# Altium project AFE001.PrjPcb
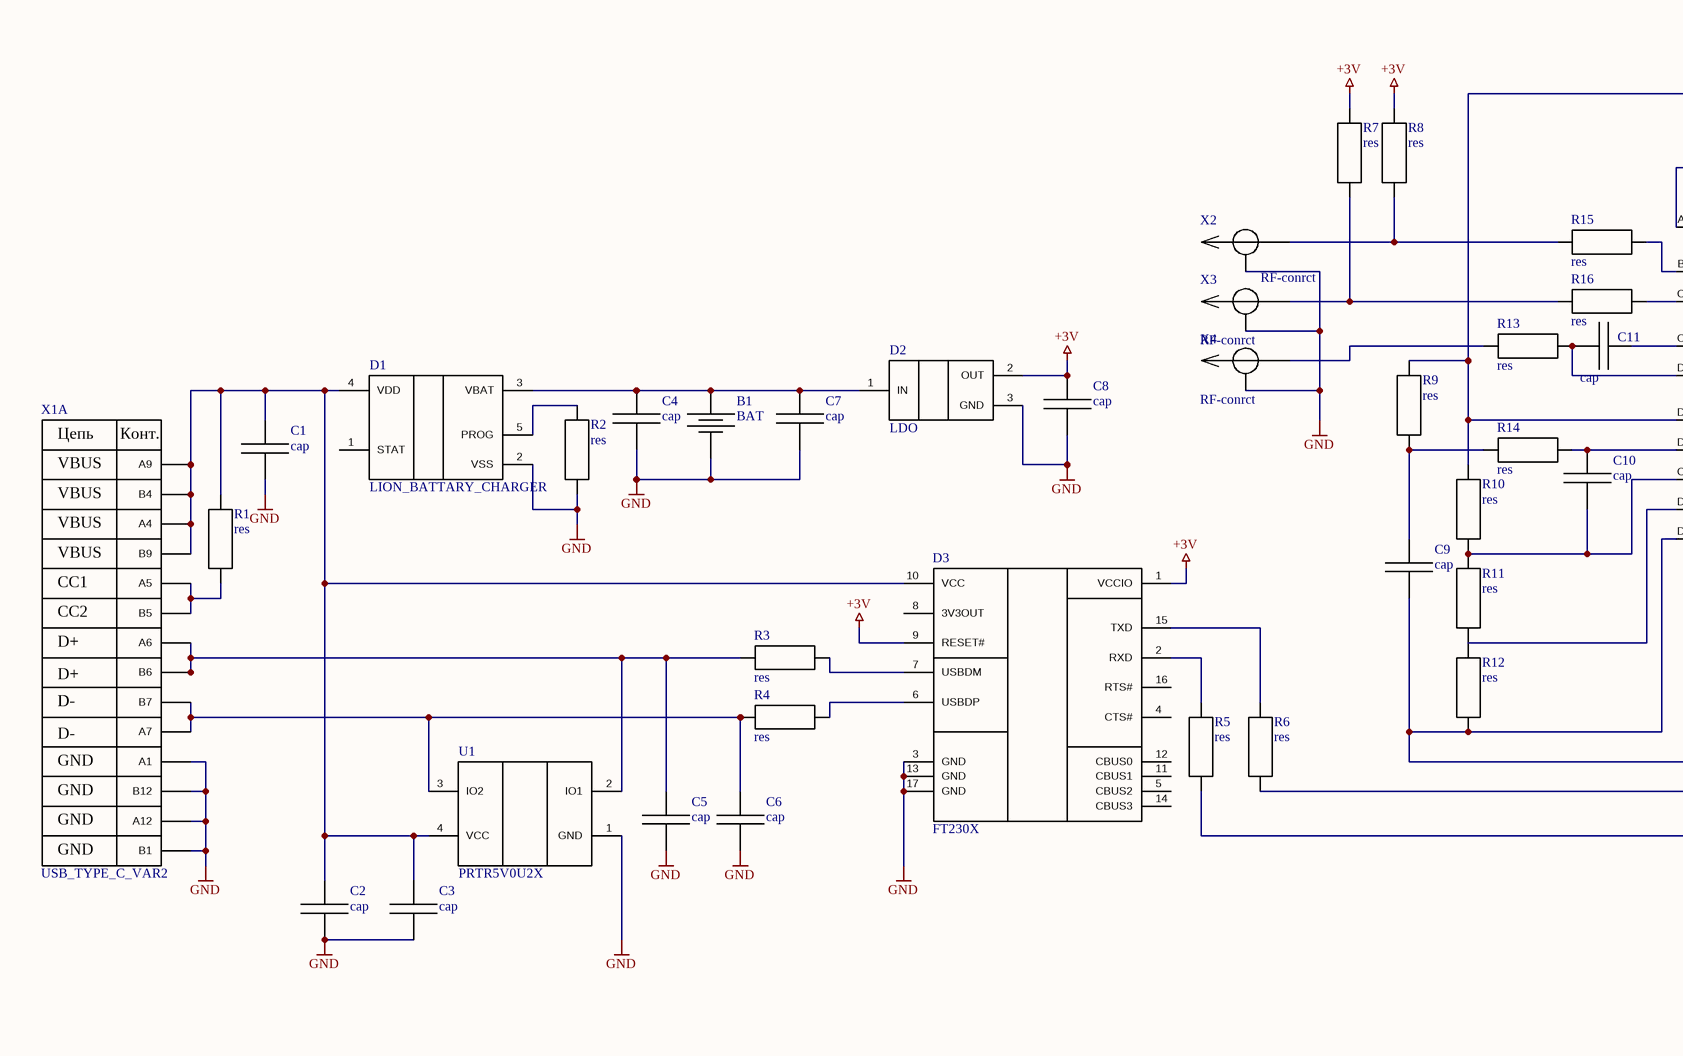
[diagram p0: Sheet1.SchDoc, left]
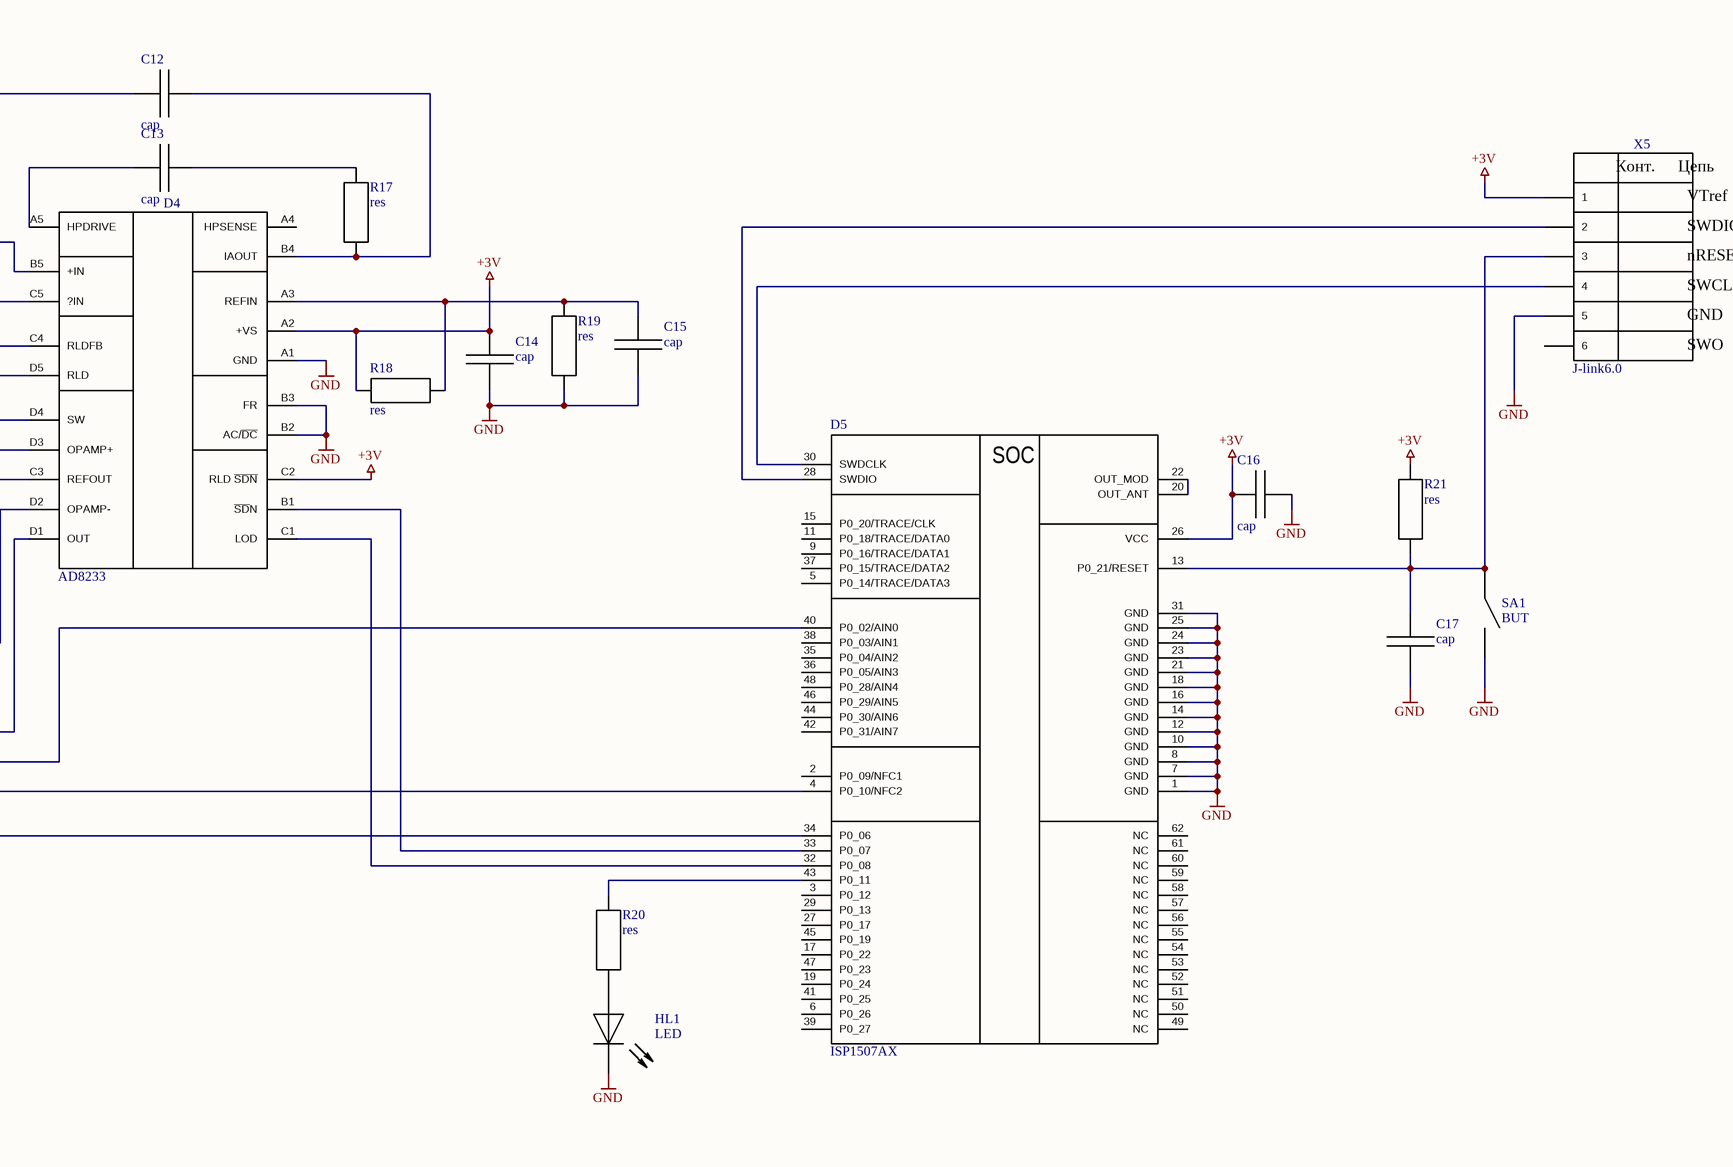
[diagram p1: Sheet1.SchDoc, right]
1 sheet, 52 parts. Net scope: global (net labels, ports and power ports of the same name join across sheets).
Board file: PCB1.PcbDoc

## Sheet Sheet1.SchDoc
size 839 x 594 mm

### Parts
B1  BAT  [lION]
C1  cap  [CAP0805]
C2  cap  [CAP0805]
C3  cap  [CAP0402]
C4  cap  [CAP0805]
C5  cap  [CAP0402]
C6  cap  [CAP0402]
C7  cap  [CAP0402]
C8  cap  [CAP0402]
C9  cap  [CAP0402]
C10  cap  [CAP0402]
C11  cap  [CAP0402]
C12  cap  [CAP0402]
C13  cap  [CAP0402]
C14  cap  [CAP0402]
C15  cap  [CAP0402]
C16  cap  [CAP0402]
C17  cap  [CAP0402]
D1  LION_BATTARY_CHARGER  [SOT95P270X15-5N]
D2  LDO  [SOT89-150P409X160-3N]
D3  FT230X  [PQFN65P400X400X80_HS-17N]
D4  AD8233  [BGA20C40P5X4_204X171X56]
D5  ISP1507AX  [LGA6C330P2X3_800X800X100]
HL1  LED  [Chip2PinSM127P600-8N]
R1  res  [RES0402]
R2  res  [RES0402]
R3  res  [RES0402]
R4  res  [RES0402]
R5  res  [RES0402]
R6  res  [RES0402]
R7  res  [RES0402]
R8  res  [RES0402]
R9  res  [RES0402]
R10  res  [RES0402]
R11  res  [RES0402]
R12  res  [RES0402]
R13  res  [RES0402]
R14  res  [RES0402]
R15  res  [RES0402]
R16  res  [RES0402]
R17  res  [RES0402]
R18  res  [RES0402]
R19  res  [RES0402]
R20  res  [RES0402]
R21  res  [RES0402]
SA1  BUT  [IT-1184]
U1  PRTR5V0U2X  [SOT143]
X1  USB_TYPE_C_VAR2  [WM12856CT-ND]  (part A of 2)
X2  RF-conrct  [1909763-1]
X3  RF-conrct  [1909763-1]
X4  RF-conrct  [1909763-1]
X5  J-link6.0  [J-Link6.]

### Nets
+3V: C8.1 C14.1 C16.1 D2.2(OUT) D3.1(VCCIO) D3.9(RESET#) D4.A2(+VS) D4.C2(RLD_~{SDN}) D5.26(VCC) R7.1 R8.1 R18.2 R21.1 X5.1
GND: B1.2 C1.2 C2.2 C3.2 C4.2 C5.2 C6.2 C7.2 C8.2 C14.2 C15.2 C16.2 C17.2 D1.2(VSS) D2.3(GND) D3.3(GND) D3.13(GND) D3.17(GND) D4.A1(GND) D4.B2(AC/~{DC}) D4.B3(FR) D5.1(GND) D5.7(GND) D5.8(GND) D5.10(GND) D5.12(GND) D5.14(GND) D5.16(GND) D5.18(GND) D5.21(GND) D5.23(GND) D5.24(GND) D5.25(GND) D5.31(GND) HL1.2(K) R2.2 R19.1 SA1.2 U1.1(GND) X1.A1 X1.A12 X1.B1 X1.B12 X2.2 X3.2 X4.2 X5.5
NetB1_1: B1.1 C4.1 C7.1 D1.3(VBAT) D2.1(IN)
NetC1_1: C1.1 C2.1 C3.1 D1.4(VDD) D3.10(VCC) R1.1 U1.4(VCC) X1.A4 X1.A9 X1.B4 X1.B9
NetC5_1: C5.1 R3.2 U1.2(IO1) X1.A6 X1.B6
NetC6_1: C6.1 R4.2 U1.3(IO2) X1.A7 X1.B7
NetC9_1: C9.1 R9.1 R14.2
NetC9_2: C9.2 D4.D1(OUT) D5.40(P0_02/AIN0) R12.1
NetC10_1: C10.1 D4.D3(OPAMP+) R14.1
NetC10_2: C10.2 D4.C3(REFOUT) R10.2 R11.1
NetC11_1: C11.1 D4.C4(RLDFB)
NetC11_2: C11.2 D4.D5(RLD) R13.1
NetC12_1: C12.1 D4.B4(IAOUT) R17.2
NetC12_2: C12.2 D4.D4(SW) R9.2 R10.1
NetC13_1: C13.1 R17.1
NetC13_2: C13.2 D4.A5(HPDRIVE)
NetC15_1: C15.1 D4.A3(REFIN) R18.1 R19.2
NetC17_1: C17.1 D5.13(P0_21/RESET) R21.2 SA1.1 X5.3
NetD1_5: D1.5(PROG) R2.1
NetD3_2: D3.2(RXD) R5.1
NetD3_6: D3.6(USBDP) R4.1
NetD3_7: D3.7(USBDM) R3.1
NetD3_15: D3.15(TXD) R6.1
NetD4_B1: D4.B1(~{SD}N) D5.33(P0_07)
NetD4_B5: D4.B5(+IN) R15.1
NetD4_C1: D4.C1(LOD) D5.32(P0_08)
NetD4_C5: D4.C5(?IN) R16.1
NetD4_D2: D4.D2(OPAMP-) R11.2 R12.2
NetD5_4: D5.4(P0_10/NFC2) R6.2
NetD5_20: D5.20(OUT_ANT) D5.22(OUT_MOD)
NetD5_28: D5.28(SWDIO) X5.2
NetD5_30: D5.30(SWDCLK) X5.4
NetD5_34: D5.34(P0_06) R5.2
NetD5_43: D5.43(P0_11) R20.1
NetHL1_1: HL1.1(A) R20.2
NetR1_2: R1.2 X1.A5 X1.B5
NetR7_2: R7.2 R16.2 X3.1
NetR8_2: R8.2 R15.2 X2.1
NetR13_2: R13.2 X4.1

Not connected (* = marked no-connect by the designer): D1 1(STAT); D3 4(CTS#) 5(CBUS2) 8(3V3OUT) 11(CBUS1) 12(CBUS0) 14(CBUS3) 16(RTS#); D4 A4(HPSENSE); D5 2(P0_09/NFC1) 3(P0_12) 5(P0_14/TRACE/DATA3) 6(P0_26) 9(P0_16/TRACE/DATA1) 11(P0_18/TRACE/DATA0) 15(P0_20/TRACE/CLK) 17(P0_22) 19(P0_24) 27(P0_17) 29(P0_13) 35(P0_04/AIN2) 36(P0_05/AIN3) 37(P0_15/TRACE/DATA2) 38(P0_03/AIN1) 39(P0_27) 41(P0_25) 42(P0_31/AIN7) 44(P0_30/AIN6) 45(P0_19) 46(P0_29/AIN5) 47(P0_23) 48(P0_28/AIN4) 49(NC) 50(NC) 51(NC) 52(NC) 53(NC) 54(NC) 55(NC) 56(NC) 57(NC) 58(NC) 59(NC) 60(NC) 61(NC) 62(NC); X5 6

### Notes on the sheet
- Подп. и дата
- Инв.№ дубл.
- Взам.инв.№
- Подп.и дата
- Инв.№ подл.
- Изм.
- Лист
- № докум.
- Подп.
- Дата
- Формат  A1
- (in symbol ISP1507) SOC
- (in symbol J-link6) Конт.; Цепь; VTref; SWDIO; nRESET; SWCLK; GND; SWO
- (in symbol WM12856CT-ND, part A) Цепь; Конт.; VBUS; CC1; CC2; D+; D-; GND

### Library data of the parts
B1 = Li-Polymer 402025: manufacturer: PKCELL; capasisctance: 150e-3; voltage: 3.7; Part Number: Li-Polymer 402025; datasheet: https://cdn-shop.adafruit.com/product-files/1317/C1515_-_Li-Polymer_402025_150mAh_3.7V_with_PCM.pdf
C1 C2 C4 = GRM21BR71C475KA73L: manufacturer: Murata; capasisctance: 4.7e-6; voltage: 16V; Part Number: GRM21BR71C475KA73L; package: 0805; datasheet: https://static.c
C3 C7 C8 C16 C17 = GRM155R71C104K: manufacturer: Murata; capasisctance: 1e-7; voltage: 10V; Part Number: GRM155R71C104K; package: 0402; datasheet: https://static.chipdip.ru/lib/250/DOC000250694.pdf
C5 C6 = GRM1555C1H470J: manufacturer: Murata; capasisctance: 4.7e-12; voltage: 16V; Part Number: GRM1555C1H470J; package: 0402; datasheet: https://static.c
C9 = GRM155R71H332KA01D: manufacturer: Murata; capasisctance: 3.3e-9; voltage: 50V; Part Number: GRM155R71H332KA01D; package: 0402; datasheet: https://static.c
C10 = GRM155R71H223KA12B: manufacturer: Murata; capasisctance: 22e-9; voltage: 50V; Part Number: GRM155R71H223KA12B; package: 0402; datasheet: https://static.c
C11 = GRM1555C1E102JA01D: manufacturer: Murata; capasisctance: 1e-9; voltage: 16V; Part Number: GRM1555C1E102JA01D; package: 0402; datasheet: https://static.c
C12 C13 = GRM155R71C224KA12D: manufacturer: Murata; capasisctance: 22e-8; voltage: 16V; Part Number: GRM155R71C224KA12D; package: 0402; datasheet: https://static.c
C14 C15 = GRM155R71C104K: manufacturer: Murata; capasisctance: 10e-5; voltage: 10V; Part Number: GRM155R71C104K; package: 0402; datasheet: https://static.chipdip.ru/lib/250/DOC000250694.pdf
D1 = MCP73831/2: manufacturer: Microchip; Part number: MCP73831/2; datasheet: D:\test_work\AFE\datasheets\power manadge\21984e.pdf
D2 = NJM78L03A: manufacturer: JRC; Part number: NJM78L03A; datasheet: D:\test_work\AFE\datasheets\power manadge\DOC000222907.pdf
D3 = FT230X: manufacturer: FTDI Chip; Part number: FT230X; datasheet: D:\test_work\AFE\datasheets\uart\DS_FT230X-5395.pdf
D4 = AD8233: manufacturer: Analog Devices; Part number: AD8233; datasheet: D:\test_work\AFE\datasheets\ad8233\AD8233.pdf
D5 = ISP1507: manufacturer: Insight Sip; Part number: ISP1507; datasheet: D:\test_work\AFE\datasheets\isp1507\isp_ble_DS1507-1221980.pdf
HL1 = KPHHS-1005CGCK: manufacturer: Kingbring; Part Number: KPHHS-1005CGCK; package: 0603; datasheet: https://static.chipdip.ru/lib/195/DOC000195322.pdf
R1 R10 R11 = RC0402FR-07100KL: manufacturer: YAGEO; resistanse: 10e5; power: 0.062; Part Number: RC0402FR-07100KL; package: 0402; datasheet: ttps://ru.mouser.com/datasheet/2/447/PYu-RC_Group_51_RoHS_L_10-1527934.pdf
R2 = RC0402FR-0713KL: manufacturer: YAGEO; resistanse: 13e3; power: 0.062; Part Number: RC0402FR-0713KL; package: 0402; datasheet: ttps://ru.mouser.com/datasheet/2/447/PYu-RC_Group_51_RoHS_L_10-1527934.pdf
R3 R4 = RC0402FR-0727RL: manufacturer: YAGEO; resistanse: 27e0; power: 0.062; Part Number: RC0402FR-0727RL; package: 0402; datasheet: ttps://ru.mouser.com/datasheet/2/447/PYu-RC_Group_51_RoHS_L_10-1527934.pdf
R5 R6 = RC0402JR-070RL: manufacturer: YAGEO; resistanse: 0; power: 0.062; Part Number: RC0402JR-070RL; package: 0402; datasheet: ttps://ru.mouser.com/datasheet/2/447/PYu-RC_Group_51_RoHS_L_10-1527934.pdf
R7 R8 R17-R19 = RC0402FR-0710ML: manufacturer: YAGEO; resistanse: 10e6; power: 0.062; Part Number: RC0402FR-0710ML; package: 0402; datasheet: ttps://ru.mouser.com/datasheet/2/447/PYu-RC_Group_51_RoHS_L_10-1527934.pdf
R9 R12 R14 = RC0402FR-071ML: manufacturer: YAGEO; resistanse: 1e6; power: 0.062; Part Number: RC0402FR-071ML; package: 0402; datasheet: ttps://ru.mouser.com/datasheet/2/447/PYu-RC_Group_51_RoHS_L_10-1527934.pdf
R13 = RC0402FR-07360KL: manufacturer: YAGEO; resistanse: 36e5; power: 0.062; Part Number: RC0402FR-07360KL; package: 0402; datasheet: ttps://ru.mouser.com/datasheet/2/447/PYu-RC_Group_51_RoHS_L_10-1527934.pdf
R15 R16 = RC0402FR-07180KL: manufacturer: YAGEO; resistanse: 18e5; power: 0.062; Part Number: RC0402FR-07180KL; package: 0402; datasheet: ttps://ru.mouser.com/datasheet/2/447/PYu-RC_Group_51_RoHS_L_10-1527934.pdf
R20 = RC0402FR-0751RL: manufacturer: YAGEO; resistanse: 51; power: 0.062; Part Number: RC0402FR-0751RL; package: 0402; datasheet: ttps://ru.mouser.com/datasheet/2/447/PYu-RC_Group_51_RoHS_L_10-1527934.pdf
R21 = RC0402FR-0710KL: manufacturer: YAGEO; resistanse: 10e3; power: 0.062; Part Number: RC0402FR-0710KL; package: 0402; datasheet: https://ru.mouser.com/datasheet/2/447/PYu-RC_Group_51_RoHS_L_10-1527934.pdf
SA1 = IT-1184: manufacturer: Switronic; pin total: 1; Part Number: IT-1184; type: but; datasheet: D:\test_work\AFE\datasheets\connectors\IT-1184 Series.pdf
X1 = WM12856CT-ND: manufacturer: Molex; pin total: 24; Part Number: WM12856CT-ND; type: USB; datasheet: D:\test_work\AFE\datasheets\usb_type_c\E1054500101_sd.pdf
X2-X4 = 1909763: manufacturer: TE; pin total: 1; Part Number: 1909763; type: RF-SMALLEST; datasheet: D:\test_work\AFE\datasheets\connectors\ENG_CD_1909763_B3.pdf
X5 = J-link6: manufacturer: Jey Link; pin total: 6; Part Number: J-link6; type: Debug; datasheet: https://www.segger.com/products/debug-probes/j-link/accessories/adapters/6-pin-needle-adapter/
U1 = PRTR5V0U2X: Part number: PRTR5V0U2X